# Altium project gravpower.PrjPcb
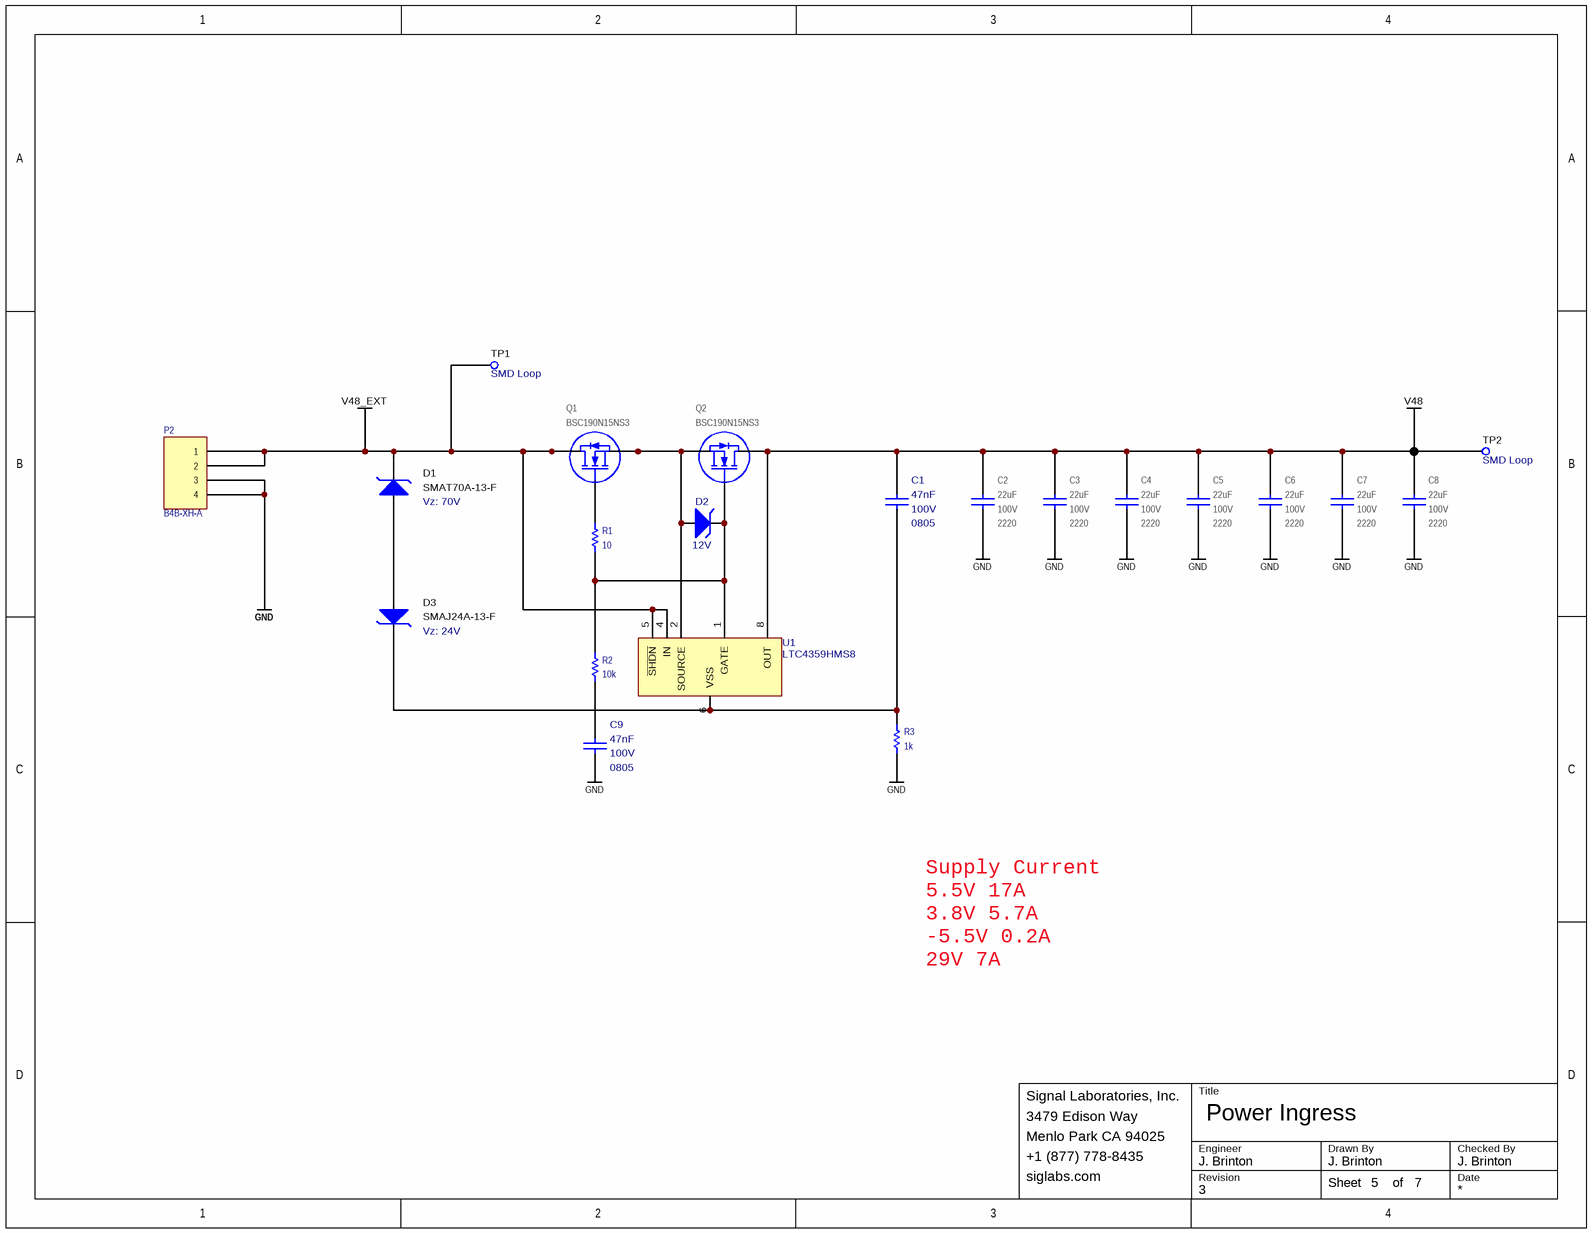
[diagram p0: ingress.SchDoc]
7 sheets, 146 parts. Net scope: global (net labels, ports and power ports of the same name join across sheets).
Board file: gravpower 007.PcbDoc
Sheets:
  ingress.SchDoc
  power-v3v8.SchDoc
  power-v5v5.SchDoc
  power-v5v5n.SchDoc
  power-v29.SchDoc
  egress.SchDoc
  mechanical.SchDoc

## Sheet ingress.SchDoc: Power Ingress
size Letter; CheckedBy: J. Brinton; CompanyName: Signal Laboratories, Inc.; DrawnBy: J. Brinton; Engineer: J. Brinton; Address1: 3479 Edison Way; Address2: Menlo Park CA 94025; Address3: +1 (877) 778-8435; Address4: siglabs.com; Revision: 3; SheetNumber: 5; SheetTotal: 7

### Parts
C1  value 47nF  Package: 0805  Voltage: 100V  [CAPC200X125X145L45N]  (hidden comment: VJ0805Y473KXB)
C2  value 22uF  Voltage: 100V  Package: 2220  [CAPC600X500X500L160N]  (hidden comment: CKG57NX7S2A226M500JJ)
C3  value 22uF  Voltage: 100V  Package: 2220  [CAPC600X500X500L160N]  (hidden comment: CKG57NX7S2A226M500JJ)
C4  value 22uF  Voltage: 100V  Package: 2220  [CAPC600X500X500L160N]  (hidden comment: CKG57NX7S2A226M500JJ)
C5  value 22uF  Voltage: 100V  Package: 2220  [CAPC600X500X500L160N]  (hidden comment: CKG57NX7S2A226M500JJ)
C6  value 22uF  Voltage: 100V  Package: 2220  [CAPC600X500X500L160N]  (hidden comment: CKG57NX7S2A226M500JJ)
C7  value 22uF  Voltage: 100V  Package: 2220  [CAPC600X500X500L160N]  (hidden comment: CKG57NX7S2A226M500JJ)
C8  value 22uF  Voltage: 100V  Package: 2220  [CAPC600X500X500L160N]  (hidden comment: CKG57NX7S2A226M500JJ)
C9  value 47nF  Package: 0805  Voltage: 100V  [CAPC200X125X145L45N]  (hidden comment: VJ0805Y473KXB)
D1  SMAT70A-13-F  Vz: 70V  [SMA]
D2  Vz: 12V  [SOD123]  (hidden comment: DDZ12BQ-7)
D3  SMAJ24A-13-F  Vz: 24V  [SMA]
P2  B4B-XH-A  [B4B-XH-A]
Q1  BSC190N15NS3  [TDSON-8]
Q2  BSC190N15NS3  [TDSON-8]
R1  value 10  [RESC1005X40N]  (hidden comment: MCS04020C1009FE000)
R2  value 10k  [RESC2012X70N]  (hidden comment: RC0805FR-0710KL)
R3  value 1k  [RESC2012X70N]  (hidden comment: RC0805FR-071KL)
TP1  Notes: SMD Loop  [5015]  (hidden comment: 5015)
TP2  Notes: SMD Loop  [5015]  (hidden comment: 5015)
U1  LTC4359HMS8  [MSOP8]

### Nets
GND: C2.1 C3.1 C4.1 C5.1 C6.1 C7.1 C8.1 C9.2 P2.3 P2.4 R3.1
V48: C1.1 C2.2 C3.2 C4.2 C5.2 C6.2 C7.2 C8.2 Q2.5(D) Q2.6(D) Q2.7(D) Q2.8(D) Q2.9(D) TP2.1 U1.8(OUT)
V48_EXT: D1.2(K) P2.1 P2.2 Q1.5(D) Q1.6(D) Q1.7(D) Q1.8(D) Q1.9(D) TP1.1 U1.4(IN) U1.5(~{SHDN})
NetC1_2: C1.2 D3.2(K) R3.2 U1.6(VSS)
NetC9_1: C9.1 R2.1
NetD1_1: D1.1(A) D3.1(A)
NetD2_1: D2.1(A) Q1.1(S) Q1.2(S) Q1.3(S) Q2.1(S) Q2.2(S) Q2.3(S) U1.2(SOURCE)
NetD2_2: D2.2(K) Q2.4(G) R1.1 R2.2 U1.1(GATE)
NetQ1_4: Q1.4(G) R1.2

Not connected (* = marked no-connect by the designer): U1 3(NC) 7(NC)

### Notes on the sheet
- Supply	Current
  5.5V	17A
  3.8V	5.7A
  -5.5V	0.2A
  29V	7A
- Title
- Engineer
- Revision
- Drawn By
- Checked By
- Date
- Sheet
- of

### Library data of the parts
C1 C9 = VJ0805Y473KXB: Ceramic Capacitor 47nF ±10% 100V X7R 0805; Manufacturer: Vishay; Tr: -55:150; Manufacturer P/N: VJ0805Y473KXB; Tolerance: ±10%
C2-C8 = CAP: Ceramic Capacitor 22uF ±20% 100V X7S Stacked; Manufacturer: TDK; Tr: -55:125; Manufacturer P/N: CKG57NX7S2A226M500JJ; Tolerance: ±20%
D1 = TVS: TVS Diode 70V/100V SMA; Manufacturer: Diodes Inc; Manufacturer P/N: SMAT70A-13-F
D2 = ZENER: Zener Diode 12V 370mW SOD123; Manufacturer: Diodes Inc; Manufacturer P/N: DDZ12BQ-7; Package: SOD-123
D3 = TVS: TVS Diode 24V/38.9V SMA; Manufacturer: Diodes Inc; Manufacturer P/N: SMAJ24A-13-F
P2 = S4B-XH-A: 2.5mm pitch 4-position connector; Manufacturer: JST; Manufacturer P/N: B4B-XH-A
Q1 Q2 = BSC190N15NS3: MOSFET N-Channel Enhancement Mode; Manufacturer: Infineon; Vds(max): 150V; Id(max): 50A; Rds(on): 19mOhm; Manufacturer P/N: BSC190N15NS3
R1 = RES: Thin Film Resistor 10 Ohm ±1% 0402; Manufacturer: Vishay; Tr: -55:155; Tcr: *; Tolerance: ±1%; Manufacturer P/N: MCS04020C1009FE000; Alternatives: *; Power: *; Package: 0402
R2 = RES: Thin Film Resistor 10k +/-1% SMD 0805; Manufacturer: Yageo; Tolerance: ±1%; Tr: -55:155; Voltage: 150V; Tcr: *; Manufacturer P/N: RC0805FR-0710KL; Alternatives: *; Power: *; Package: 0805
R3 = RES: Thin Film Resistor 1k +/-1% SMD 0805; Manufacturer: Yageo; Tolerance: ±1%; Tr: -55:155; Voltage: 150V; Tcr: *; Manufacturer P/N: RC0805FR-071KL; Alternatives: *; Power: *; Package: 0805
TP1 TP2 = TEST_POINT_SMD_50: Test Point SMD; Manufacturer: Keystone; Manufacturer P/N: 5015
U1 = LTC4359HMS8: Ideal Diode Controller; Manufacturer: Linear Technology; Manufacturer P/N: LTC4359HMS8

## Sheet power-v3v8.SchDoc: Power 3.8V
size Letter; CheckedBy: J. Brinton; CompanyName: Signal Laboratories, Inc.; DrawnBy: J. Brinton; Engineer: J. Brinton; Address1: 3479 Edison Way; Address2: Menlo Park CA 94025; Address3: +1 (877) 778-8435; Address4: siglabs.com; Revision: 3; SheetNumber: 3; SheetTotal: 7
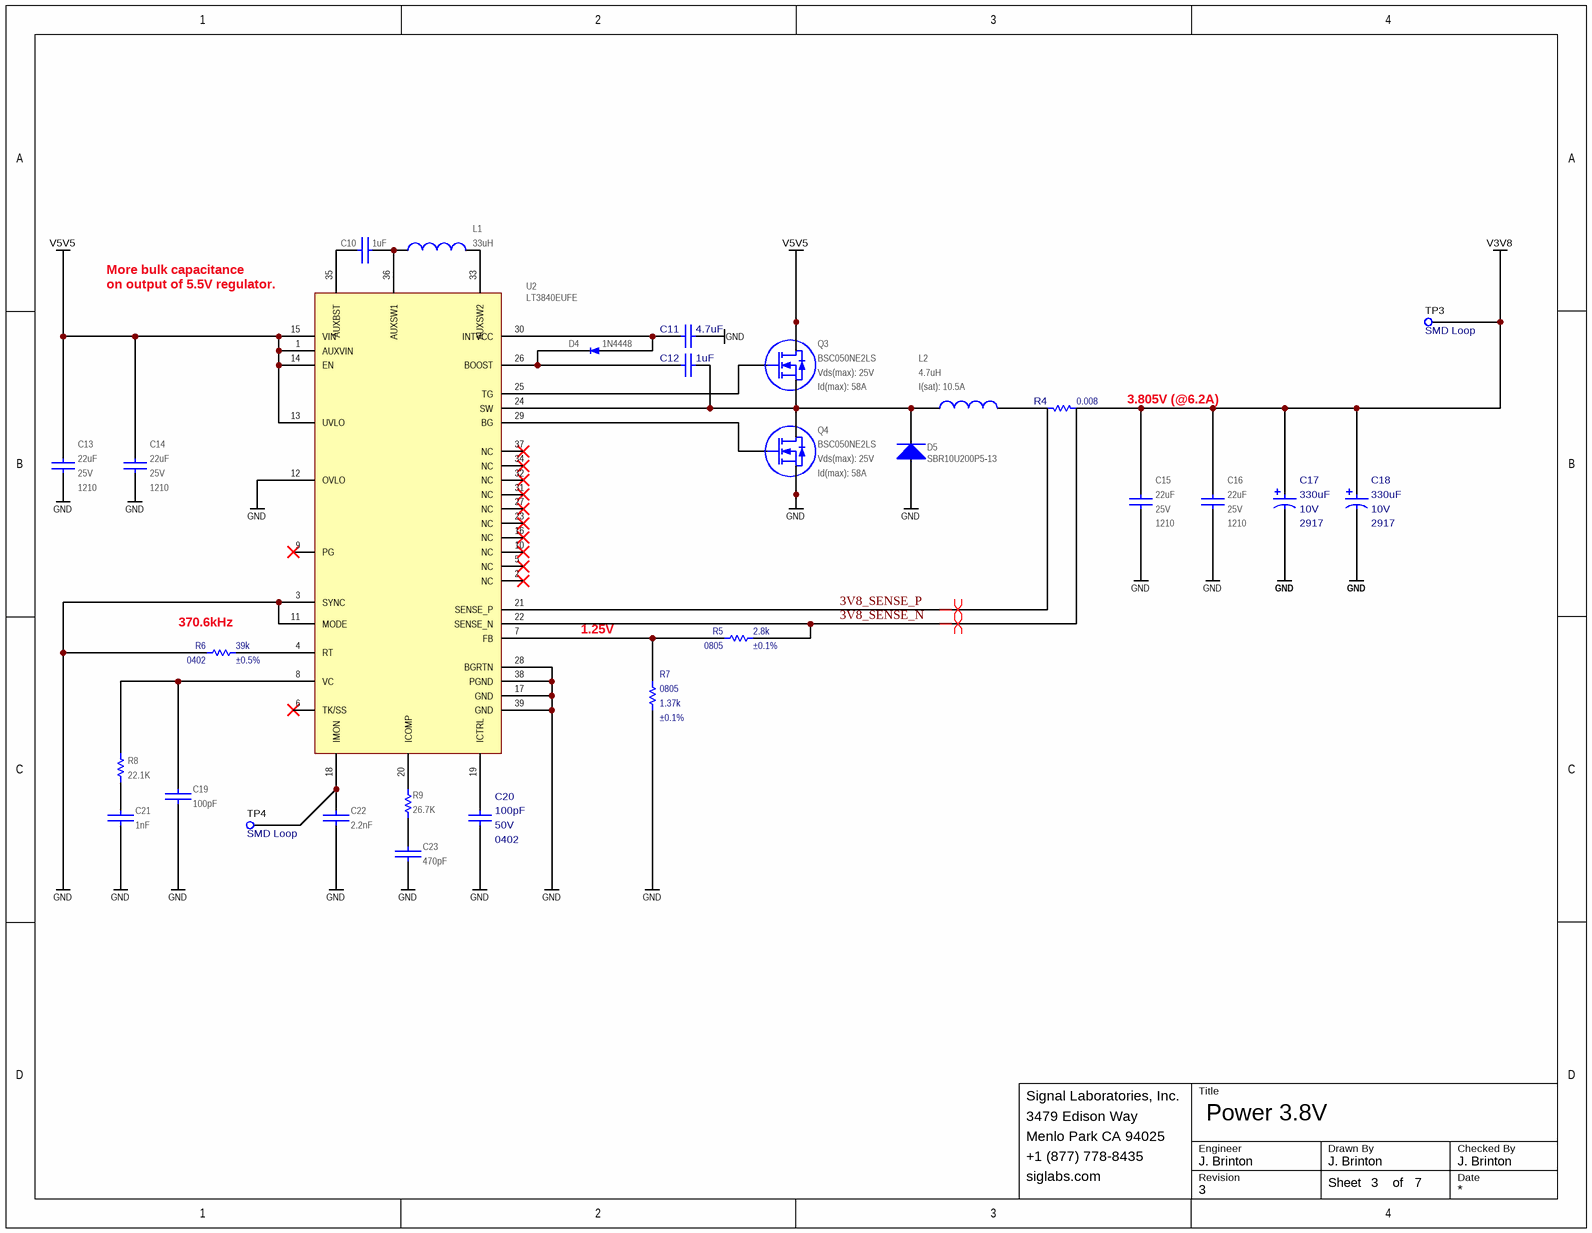
[diagram p1: power-v3v8.SchDoc]

### Parts
C10  value 1uF  [CAPC100X50X55L25N]  (hidden comment: GRM155R61A105KE15)
C11  value 4.7uF  [CAPC160X80X90L20NA]  (hidden comment: CL10A475KA8NQNC)
C12  value 1uF  [CAPC100X50X55L25N]  (hidden comment: GRM155R61A105KE15)
C13  value 22uF  Voltage: 25V  Package: 1210  [CAPC320X250X270L50N]  (hidden comment: GRM32ER71E226KE15)
C14  value 22uF  Voltage: 25V  Package: 1210  [CAPC320X250X270L50N]  (hidden comment: GRM32ER71E226KE15)
C15  value 22uF  Voltage: 25V  Package: 1210  [CAPC320X250X270L50N]  (hidden comment: GRM32ER71E226KE15)
C16  value 22uF  Voltage: 25V  Package: 1210  [CAPC320X250X270L50N]  (hidden comment: GRM32ER71E226KE15)
C17  value 330uF  Package: 2917  Voltage: 10V  [CAPPM730X435X310L135X240N]  (hidden comment: TPSE337K010R0050)
C18  value 330uF  Package: 2917  Voltage: 10V  [CAPPM730X435X310L135X240N]  (hidden comment: TPSE337K010R0050)
C19  value 100pF  [CAPC100X50X55L25N]  (hidden comment: GRM1555C1H101FA01D)
C20  value 100pF  Package: 0402  Voltage: 50V  [CAPC100X50X55L25N]  (hidden comment: VJ0402A101KXA)
C21  value 1nF  [CAPC100X50X55L25N]  (hidden comment: GRM1555C1H102JA01)
C22  value 2.2nF  [CAPC100X50X55L25N]  (hidden comment: C0402C222J3GACTU)
C23  value 470pF  [CAPC100X50X55L25N]  (hidden comment: GRM155R71H471JA01)
D4  Alternative P/N: 1N4448  [SOD323]  (hidden comment: 1N4448HWS-7-F)
D5  SBR10U200P5-13  [DIODES_POWERDI5]
L1  value 33uH  [ME3220]  (hidden comment: ME3220-333KL)
L2  value 4.7uH  I(sat): 10.5A  [XAL6060]  (hidden comment: XAL6060-472ME)
Q3  BSC050NE2LS  Vds(max): 25V  Id(max): 58A  [TDSON-8]
Q4  BSC050NE2LS  Vds(max): 25V  Id(max): 58A  [TDSON-8]
R4  value 0.008  [KRL3216T4]  (hidden comment: KRL3216T4A-M-R008-F)
R5  value 2.8k  Tolerance: ±0.1%  Package: 0805  [RESC2012X70N]  (hidden comment: RT0805BRD072K8L)
R6  value 39k  Tolerance: ±0.5%  Package: 0402  [RESC1005X40N]  (hidden comment: RR0510P-393-D)
R7  value 1.37k  Tolerance: ±0.1%  Package: 0805  [RESC2012X70N]  (hidden comment: RT0805BRD071K37L)
R8  value 22.1K  [RESC1005X40N]  (hidden comment: ERJ-2RKF2212X)
R9  value 26.7K  [RESC1005X40N]  (hidden comment: ERJ-2RKF2672X)
TP3  Notes: SMD Loop  [5015]  (hidden comment: 5015)
TP4  Notes: SMD Loop  [5015]  (hidden comment: 5015)
U2  LT3840EUFE  [QFN39P40_600X400X80L40X20T465X265N]

### Nets
GND: C11.2 C13.1 C14.1 C15.1 C16.1 C17.2 C18.2 C19.1 C20.2 C21.2 C22.2 C23.1 D5.A Q4.1(S) Q4.2(S) Q4.3(S) R6.2 R7.1 U2.3(SYNC) U2.11(MODE) U2.12(OVLO) U2.17(GND) U2.28(BGRTN) U2.38(PGND) U2.39(GND)
V3V8: C15.2 C16.2 C17.1 C18.1 R4.2 TP3.1
V5V5: C13.2 C14.2 Q3.5(D) Q3.6(D) Q3.7(D) Q3.8(D) Q3.9(D) U2.1(AUXVIN) U2.13(UVLO) U2.14(EN) U2.15(VIN)
3V8_SENSE_N: R4.4 R5.1 U2.22(SENSE_N)
3V8_SENSE_P: R4.3 U2.21(SENSE_P)
NetC10_1: C10.1 L1.1 U2.36(AUXSW1)
NetC10_2: C10.2 U2.35(AUXBST)
NetC11_1: C11.1 D4.A U2.30(INTVCC)
NetC12_1: C12.1 D4.K U2.26(BOOST)
NetC12_2: C12.2 D5.K L2.1 Q3.1(S) Q3.2(S) Q3.3(S) Q4.5(D) Q4.6(D) Q4.7(D) Q4.8(D) Q4.9(D) U2.24(SW)
NetC19_2: C19.2 R8.2 U2.8(VC)
NetC20_1: C20.1 U2.19(ICTRL)
NetC21_1: C21.1 R8.1
NetC22_1: C22.1 TP4.1 U2.18(IMON)
NetC23_2: C23.2 R9.2
NetL1_2: L1.2 U2.33(AUXSW2)
NetL2_2: L2.2 R4.1
NetQ3_4: Q3.4(G) U2.25(TG)
NetQ4_4: Q4.4(G) U2.29(BG)
NetR5_2: R5.2 R7.2 U2.7(FB)
NetR6_1: R6.1 U2.4(RT)
NetR9_1: R9.1 U2.20(ICOMP)

Not connected (* = marked no-connect by the designer): U2 2(NC)* 5(NC)* 6(TK/SS)* 9(PG)* 10(NC)* 16(NC)* 23(NC)* 27(NC)* 31(NC)* 32(NC)* 34(NC)* 37(NC)*

### Layout directives
differential pair: 3V8_SENSE_N, 3V8_SENSE_P

### Notes on the sheet
- More bulk capacitance
- (near U2) on output of 5.5V regulator.
- (near R4) 3.805V (@6.2A)
- (near R6) 370.6kHz
- 1.25V
- Title
- Engineer
- Revision
- Drawn By
- Checked By
- Date
- Sheet
- of

### Library data of the parts
C10 = CAP: Ceramic Capacitor 1uF ±10% 10V X5R 0402; Manufacturer: Murata; Tr: -55:125; Manufacturer P/N: GRM155R61A105KE15; Package: 0402; Tolerance: ±10%; Voltage: 10V
C11 = TMK212B7475KG: Ceramic Capacitor 4.7uF ±10% 25V X5R 0603; Manufacturer: Samsung; Tr: -55:85; Manufacturer P/N: CL10A475KA8NQNC; Tolerance: ±10%; Package: 0603; Voltage: 25V
C12 = UMK212B7105KG: Ceramic Capacitor 1uF ±10% 10V X5R 0402; Manufacturer: Murata; Voltage: 50V; Manufacturer P/N: GRM155R61A105KE15; Tolerance: ±10%; Tr: *; Package: 0402
C13-C16 = CAP: Ceramic Capacitor 22uF ±10% 25V X7R 1210; Manufacturer: Murata; Tr: -55:125; Manufacturer P/N: GRM32ER71E226KE15; Tolerance: ±10%
C17 C18 = CAP_POL: Tantalum Capacitor 330uF ±10% 10V 2917; Manufacturer: AVX; Tr: -55:125; Manufacturer P/N: TPSE337K010R0050; Tolerance: ±10%
C19 = CAP: Ceramic Capacitor 100pF ±1% 50V NP0 0402; Manufacturer: Murata; Tr: -55:125; Manufacturer P/N: GRM1555C1H101FA01D; Voltage: 50V; Package: 0402; Tolerance: ±1%
C20 = VJ0402A101KXA: Ceramic Capacitor 100pF ±10% 50V C0G 0402; Manufacturer: Vishay; Tr: -55:150; Manufacturer P/N: VJ0402A101KXA; Tolerance: ±10%
C21 = CAP: Ceramic Capacitor 1nF ±5% 50V NP0 0402; Manufacturer: Murata; Tr: -55:125; Manufacturer P/N: GRM1555C1H102JA01; Voltage: 50V; Package: 0402; Tolerance: ±5%
C22 = CAP: Ceramic Capacitor 2.2nF ±5% 25V NP0 0402; Manufacturer: Kemet; Tr: -55:125; Manufacturer P/N: C0402C222J3GACTU; Package: 0402; Tolerance: ±5%; Voltage: 25V
C23 = CAP: Ceramic Capacitor 470pF ±5% 50V X7R 0402; Manufacturer: Murata; Tr: -55:125; Manufacturer P/N: GRM155R71H471JA01; Voltage: 50V; Package: 0402; Tolerance: ±5%
D4 = 1N4448HWS-7-F: Schottky Diode 80V 250mA SOD323; Manufacturer: Diodes Inc; Manufacturer P/N: 1N4448HWS-7-F; Package: SOD323
D5 = PDS5100H: Schottky Diode 200V 10A SMD; Manufacturer: Diodes Inc; Manufacturer P/N: SBR10U200P5-13; Current: 10A; Reverse Voltage (max): 200V; Package: PowerDi-5
L1 = COIL: Inductor 33uH ±10% 500mA SMD; Manufacturer: Coilcraft; Tr: -40:85; Manufacturer P/N: ME3220-333KL; I(sat): 500mA; Package: *; Tolerance: ±10%
L2 = COIL: Inductor 4.7uH,10.5A(sat), SMD; Manufacturer: Coilcraft; Manufacturer P/N: XAL6060-472ME
Q3 Q4 = BSC190N15NS3: MOSFET N-Channel Enhancement Mode; Manufacturer: Infineon; Rds(on): 5mOhm; Manufacturer P/N: BSC050NE2LS
R4 = KRL3216T4A-M-R009-F: Current Sense Resistor 8 mOhms +/-1% SMD 4-Terminal; Manufacturer: Susumu; Tolerance: ±1%; Tr: -55:+155; Manufacturer P/N: KRL3216T4A-M-R008-F
R5 = RES: Thin Film Resistor 2.8k +/-0.1% SMD 0805; Manufacturer: Yageo; Tr: -55:155; Tcr: *; Manufacturer P/N: RT0805BRD072K8L; Alternatives: *; Voltage: *; Power: *
R6 = RES: Thin Film Resistor 39k +/-0.5% SMD 0402; Manufacturer: Susumu; Tr: -55:155; Tcr: *; Manufacturer P/N: RR0510P-393-D; Alternatives: *; Voltage: *; Power: *
R7 = RES: Thin Film Resistor 1.37k +/-0.1% SMD 0805; Manufacturer: Yageo; Tr: -55:155; Tcr: *; Manufacturer P/N: RT0805BRD071K37L; Alternatives: *; Voltage: *; Power: *
R8 = RES 0402: Thick Film Resistor 22.1k ±1% 0402; Manufacturer: Panasonic; Tr: -55:155; Package: 0402; Manufacturer P/N: ERJ-2RKF2212X; Tolerance: ±1%
R9 = RES 0402: Thick Film Resistor 26.7k ±1% 0402; Manufacturer: Panasonic; Tr: -55:155; Package: 0402; Manufacturer P/N: ERJ-2RKF2672X; Tolerance: ±1%
TP3 TP4 = TEST_POINT_SMD_50: Test Point SMD; Manufacturer: Keystone; Manufacturer P/N: 5015
U2 = LT3840EUFE: Synchronous Regulator Controller; Manufacturer: Linear Technology; Alternative P/N: LT3840IUFE; Manufacturer P/N: LT3840EUFE

## Sheet power-v5v5.SchDoc: Power 5.5V
size Letter; CheckedBy: J. Brinton; CompanyName: Signal Laboratories, Inc.; DrawnBy: J. Brinton; Engineer: J. Brinton; Address1: 3479 Edison Way; Address2: Menlo Park CA 94025; Address3: +1 (877) 778-8435; Address4: siglabs.com; Revision: 3; SheetNumber: 2; SheetTotal: 7
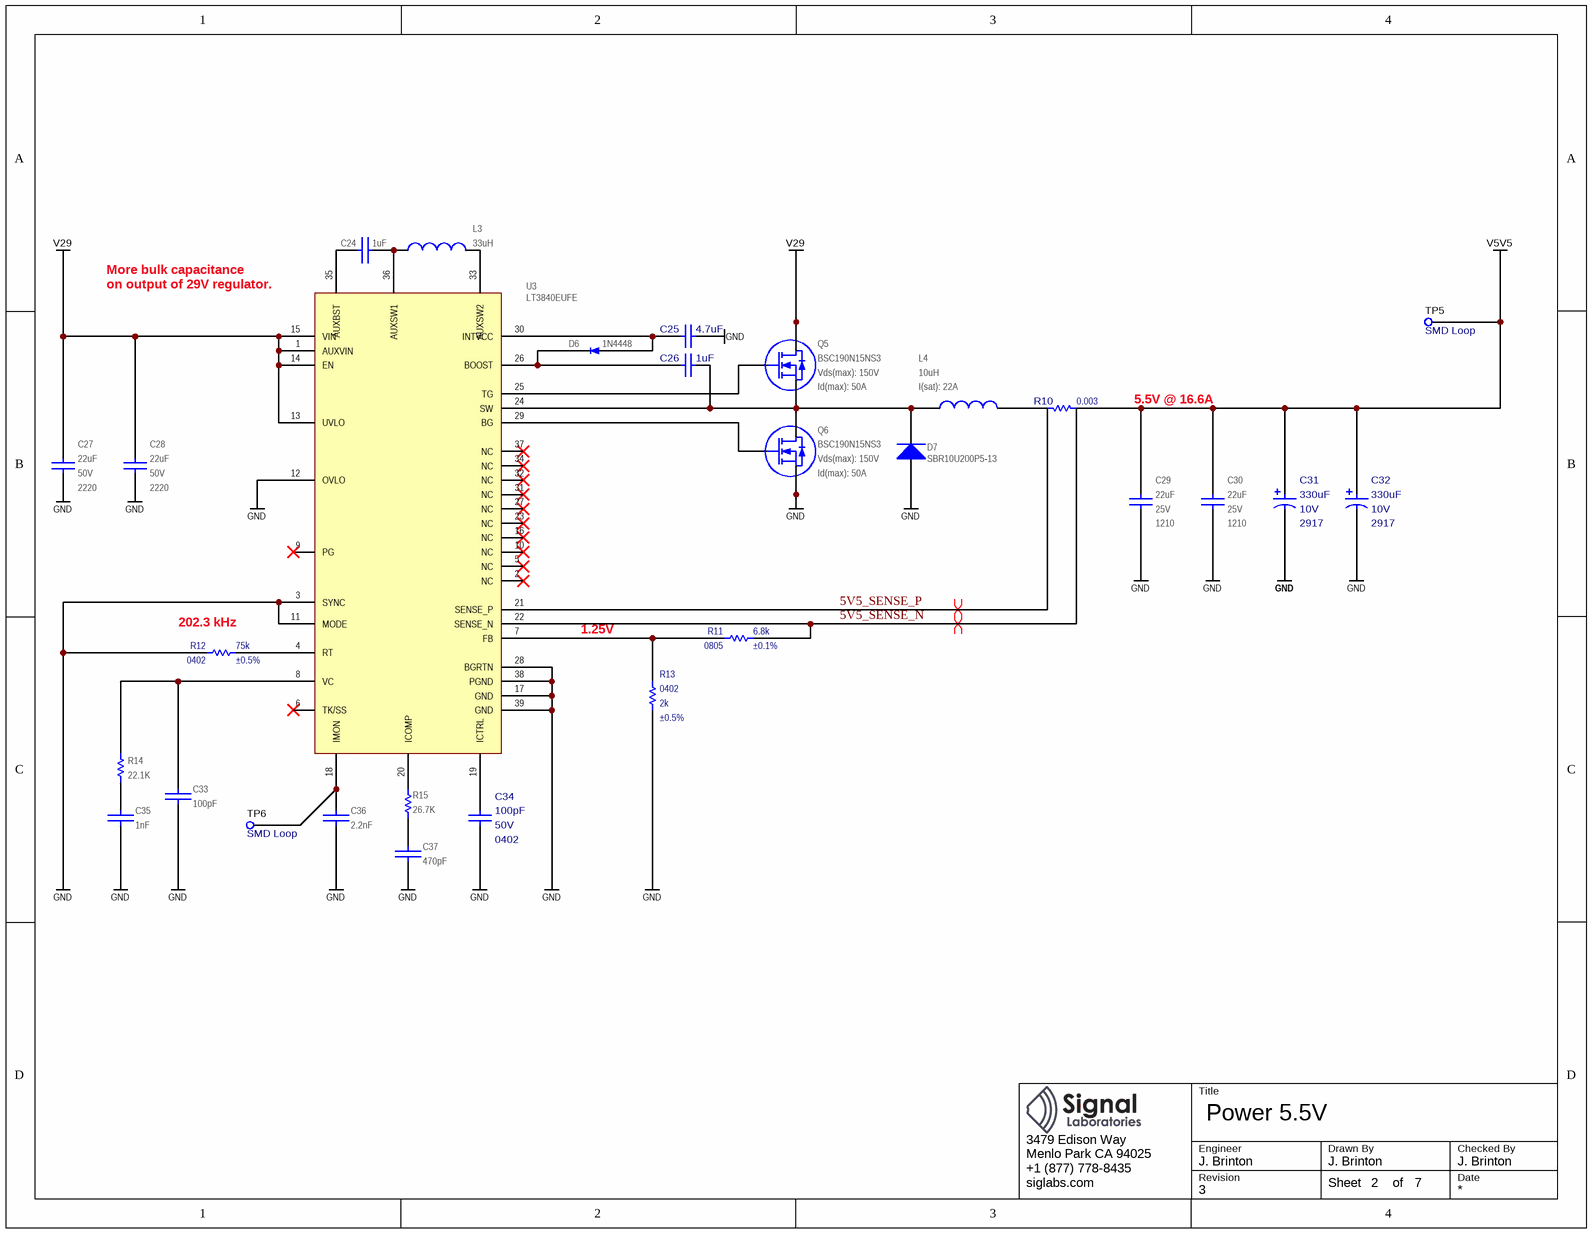
[diagram p2: power-v5v5.SchDoc]

### Parts
C24  value 1uF  [CAPC100X50X55L25N]  (hidden comment: GRM155R61A105KE15)
C25  value 4.7uF  [CAPC160X80X90L20NA]  (hidden comment: CL10A475KA8NQNC)
C26  value 1uF  [CAPC100X50X55L25N]  (hidden comment: GRM155R61A105KE15)
C27  value 22uF  Voltage: 50V  Package: 2220  [CAPC600X500X500L160N]  (hidden comment: CKG57NX7S1H226M500JJ)
C28  value 22uF  Voltage: 50V  Package: 2220  [CAPC600X500X500L160N]  (hidden comment: CKG57NX7S1H226M500JJ)
C29  value 22uF  Voltage: 25V  Package: 1210  [CAPC320X250X270L50N]  (hidden comment: GRM32ER71E226KE15)
C30  value 22uF  Voltage: 25V  Package: 1210  [CAPC320X250X270L50N]  (hidden comment: GRM32ER71E226KE15)
C31  value 330uF  Package: 2917  Voltage: 10V  [CAPPM730X435X310L135X240N]  (hidden comment: TPSE337K010R0050)
C32  value 330uF  Package: 2917  Voltage: 10V  [CAPPM730X435X310L135X240N]  (hidden comment: TPSE337K010R0050)
C33  value 100pF  [CAPC100X50X55L25N]  (hidden comment: GRM1555C1H101FA01D)
C34  value 100pF  Package: 0402  Voltage: 50V  [CAPC100X50X55L25N]  (hidden comment: VJ0402A101KXA)
C35  value 1nF  [CAPC100X50X55L25N]  (hidden comment: GRM1555C1H102JA01)
C36  value 2.2nF  [CAPC100X50X55L25N]  (hidden comment: C0402C222J3GACTU)
C37  value 470pF  [CAPC100X50X55L25N]  (hidden comment: GRM155R71H471JA01)
D6  Alternative P/N: 1N4448  [SOD323]  (hidden comment: 1N4448HWS-7-F)
D7  SBR10U200P5-13  [DIODES_POWERDI5]
L3  value 33uH  [ME3220]  (hidden comment: ME3220-333KL)
L4  value 10uH  I(sat): 22A  [HCM1A1707]  (hidden comment: PA4344.103ANLT)
Q5  BSC190N15NS3  Vds(max): 150V  Id(max): 50A  [TDSON-8]
Q6  BSC190N15NS3  Vds(max): 150V  Id(max): 50A  [TDSON-8]
R10  value 0.003  [KRL3216T4]  (hidden comment: KRL3216T4A-M-R003-F)
R11  value 6.8k  Tolerance: ±0.1%  Package: 0805  [RESC2012X70N]  (hidden comment: RG2012P-682-B-T5)
R12  value 75k  Tolerance: ±0.5%  Package: 0402  [RESC1005X40N]  (hidden comment: RR0510P-753-D)
R13  value 2k  Tolerance: ±0.5%  Package: 0402  [RESC1005X40N]  (hidden comment: RR0510P-202-D)
R14  value 22.1K  [RESC1005X40N]  (hidden comment: ERJ-2RKF2212X)
R15  value 26.7K  [RESC1005X40N]  (hidden comment: ERJ-2RKF2672X)
TP5  Notes: SMD Loop  [5015]  (hidden comment: 5015)
TP6  Notes: SMD Loop  [5015]  (hidden comment: 5015)
U3  LT3840EUFE  [QFN39P40_600X400X80L40X20T465X265N]

### Nets
GND: C25.2 C27.1 C28.1 C29.1 C30.1 C31.2 C32.2 C33.1 C34.2 C35.2 C36.2 C37.1 D7.A Q6.1(S) Q6.2(S) Q6.3(S) R12.2 R13.1 U3.3(SYNC) U3.11(MODE) U3.12(OVLO) U3.17(GND) U3.28(BGRTN) U3.38(PGND) U3.39(GND)
V5V5: C29.2 C30.2 C31.1 C32.1 R10.2 TP5.1
V29: C27.2 C28.2 Q5.5(D) Q5.6(D) Q5.7(D) Q5.8(D) Q5.9(D) U3.1(AUXVIN) U3.13(UVLO) U3.14(EN) U3.15(VIN)
5V5_SENSE_N: R10.4 R11.1 U3.22(SENSE_N)
5V5_SENSE_P: R10.3 U3.21(SENSE_P)
NetC24_1: C24.1 L3.1 U3.36(AUXSW1)
NetC24_2: C24.2 U3.35(AUXBST)
NetC25_1: C25.1 D6.A U3.30(INTVCC)
NetC26_1: C26.1 D6.K U3.26(BOOST)
NetC26_2: C26.2 D7.K L4.1 Q5.1(S) Q5.2(S) Q5.3(S) Q6.5(D) Q6.6(D) Q6.7(D) Q6.8(D) Q6.9(D) U3.24(SW)
NetC33_2: C33.2 R14.2 U3.8(VC)
NetC34_1: C34.1 U3.19(ICTRL)
NetC35_1: C35.1 R14.1
NetC36_1: C36.1 TP6.1 U3.18(IMON)
NetC37_2: C37.2 R15.2
NetL3_2: L3.2 U3.33(AUXSW2)
NetL4_2: L4.2 R10.1
NetQ5_4: Q5.4(G) U3.25(TG)
NetQ6_4: Q6.4(G) U3.29(BG)
NetR11_2: R11.2 R13.2 U3.7(FB)
NetR12_1: R12.1 U3.4(RT)
NetR15_1: R15.1 U3.20(ICOMP)

Not connected (* = marked no-connect by the designer): U3 2(NC)* 5(NC)* 6(TK/SS)* 9(PG)* 10(NC)* 16(NC)* 23(NC)* 27(NC)* 31(NC)* 32(NC)* 34(NC)* 37(NC)*

### Layout directives
differential pair: 5V5_SENSE_N, 5V5_SENSE_P

### Notes on the sheet
- More bulk capacitance
- (near U3) on output of 29V regulator.
- 5.5V @ 16.6A
- (near R12) 202.3 kHz
- 1.25V
- Title
- Engineer
- Revision
- Drawn By
- Checked By
- Date
- Sheet
- of

### Library data of the parts
C24 = CAP: as C10 on sheet power-v3v8; Manufacturer P/N: GRM155R61A105KE15; Package: 0402; Tolerance: ±10%; Voltage: 10V
C25 = TMK212B7475KG: as C11 on sheet power-v3v8; Manufacturer P/N: CL10A475KA8NQNC; Tolerance: ±10%; Package: 0603; Voltage: 25V
C26 = UMK212B7105KG: as C12 on sheet power-v3v8; Manufacturer P/N: GRM155R61A105KE15; Tolerance: ±10%; Tr: *; Package: 0402
C27 C28 = CAP: Ceramic Capacitor 22uF ±20% 50V X7S Stacked; Manufacturer: TDK; Tr: -55:125; Manufacturer P/N: CKG57NX7S1H226M500JJ; Tolerance: ±20%
C29 C30 = CAP: as C13 on sheet power-v3v8; Manufacturer P/N: GRM32ER71E226KE15; Tolerance: ±10%
C31 C32 = CAP_POL: as C17 on sheet power-v3v8; Manufacturer P/N: TPSE337K010R0050; Tolerance: ±10%
C33 = CAP: as C19 on sheet power-v3v8; Manufacturer P/N: GRM1555C1H101FA01D; Voltage: 50V; Package: 0402; Tolerance: ±1%
C34 = VJ0402A101KXA: as C20 on sheet power-v3v8; Manufacturer P/N: VJ0402A101KXA; Tolerance: ±10%
C35 = CAP: as C21 on sheet power-v3v8; Manufacturer P/N: GRM1555C1H102JA01; Voltage: 50V; Package: 0402; Tolerance: ±5%
C36 = CAP: as C22 on sheet power-v3v8; Manufacturer P/N: C0402C222J3GACTU; Package: 0402; Tolerance: ±5%; Voltage: 25V
C37 = CAP: as C23 on sheet power-v3v8; Manufacturer P/N: GRM155R71H471JA01; Voltage: 50V; Package: 0402; Tolerance: ±5%
D6 = 1N4448HWS-7-F: as D4 on sheet power-v3v8; Manufacturer P/N: 1N4448HWS-7-F; Package: SOD323
D7 = PDS5100H: as D5 on sheet power-v3v8; Manufacturer P/N: SBR10U200P5-13; Current: 10A; Reverse Voltage (max): 200V; Package: PowerDi-5
L3 = COIL: as L1 on sheet power-v3v8; Manufacturer P/N: ME3220-333KL; I(sat): 500mA; Package: *; Tolerance: ±10%
L4 = COIL: Inductor 10uH, 22A(sat), SMD; Manufacturer: Pulse Electronics Power; Notes: Same size inductor as HCM1A1707; Manufacturer P/N: PA4344.103ANLT
Q5 Q6 = BSC190N15NS3: MOSFET N-Channel Enhancement Mode; Manufacturer: Infineon; Rds(on): 19mOhm; Manufacturer P/N: BSC190N15NS3
R10 = KRL3216T4A-M-R009-F: Current Sense Resistor 3 mOhms +/-1% SMD 4-Terminal; Manufacturer: Susumu; Tolerance: ±1%; Tr: -55:+155; Manufacturer P/N: KRL3216T4A-M-R003-F
R11 = RES: Thin Film Resistor 6.8k +/-0.1% SMD 0805; Manufacturer: Susumu; Tr: -55:155; Tcr: *; Manufacturer P/N: RG2012P-682-B-T5; Alternatives: *; Voltage: *; Power: *
R12 = RES: Thin Film Resistor 75k +/-0.5% SMD 0402; Manufacturer: Susumu; Tr: -55:155; Tcr: *; Manufacturer P/N: RR0510P-753-D; Alternatives: *; Voltage: *; Power: *
R13 = RES: Thin Film Resistor 2k +/-0.5% SMD 0402; Manufacturer: Susumu; Tr: -55:155; Tcr: *; Manufacturer P/N: RR0510P-202-D; Alternatives: *; Voltage: *; Power: *
R14 = RES 0402: as R8 on sheet power-v3v8; Package: 0402; Manufacturer P/N: ERJ-2RKF2212X; Tolerance: ±1%
R15 = RES 0402: as R9 on sheet power-v3v8; Package: 0402; Manufacturer P/N: ERJ-2RKF2672X; Tolerance: ±1%
TP5 TP6 = TEST_POINT_SMD_50: Test Point SMD; Manufacturer: Keystone; Manufacturer P/N: 5015
U3 = LT3840EUFE: as U2 on sheet power-v3v8; Manufacturer P/N: LT3840EUFE

## Sheet power-v5v5n.SchDoc: Power -5.5V
size Letter; CheckedBy: J. Brinton; CompanyName: Signal Laboratories, Inc.; DrawnBy: J. Brinton; Engineer: J. Brinton; Address1: 3479 Edison Way; Address2: Menlo Park CA 94025; Address3: +1 (877) 778-8435; Address4: siglabs.com; Revision: 3; SheetNumber: 4; SheetTotal: 7
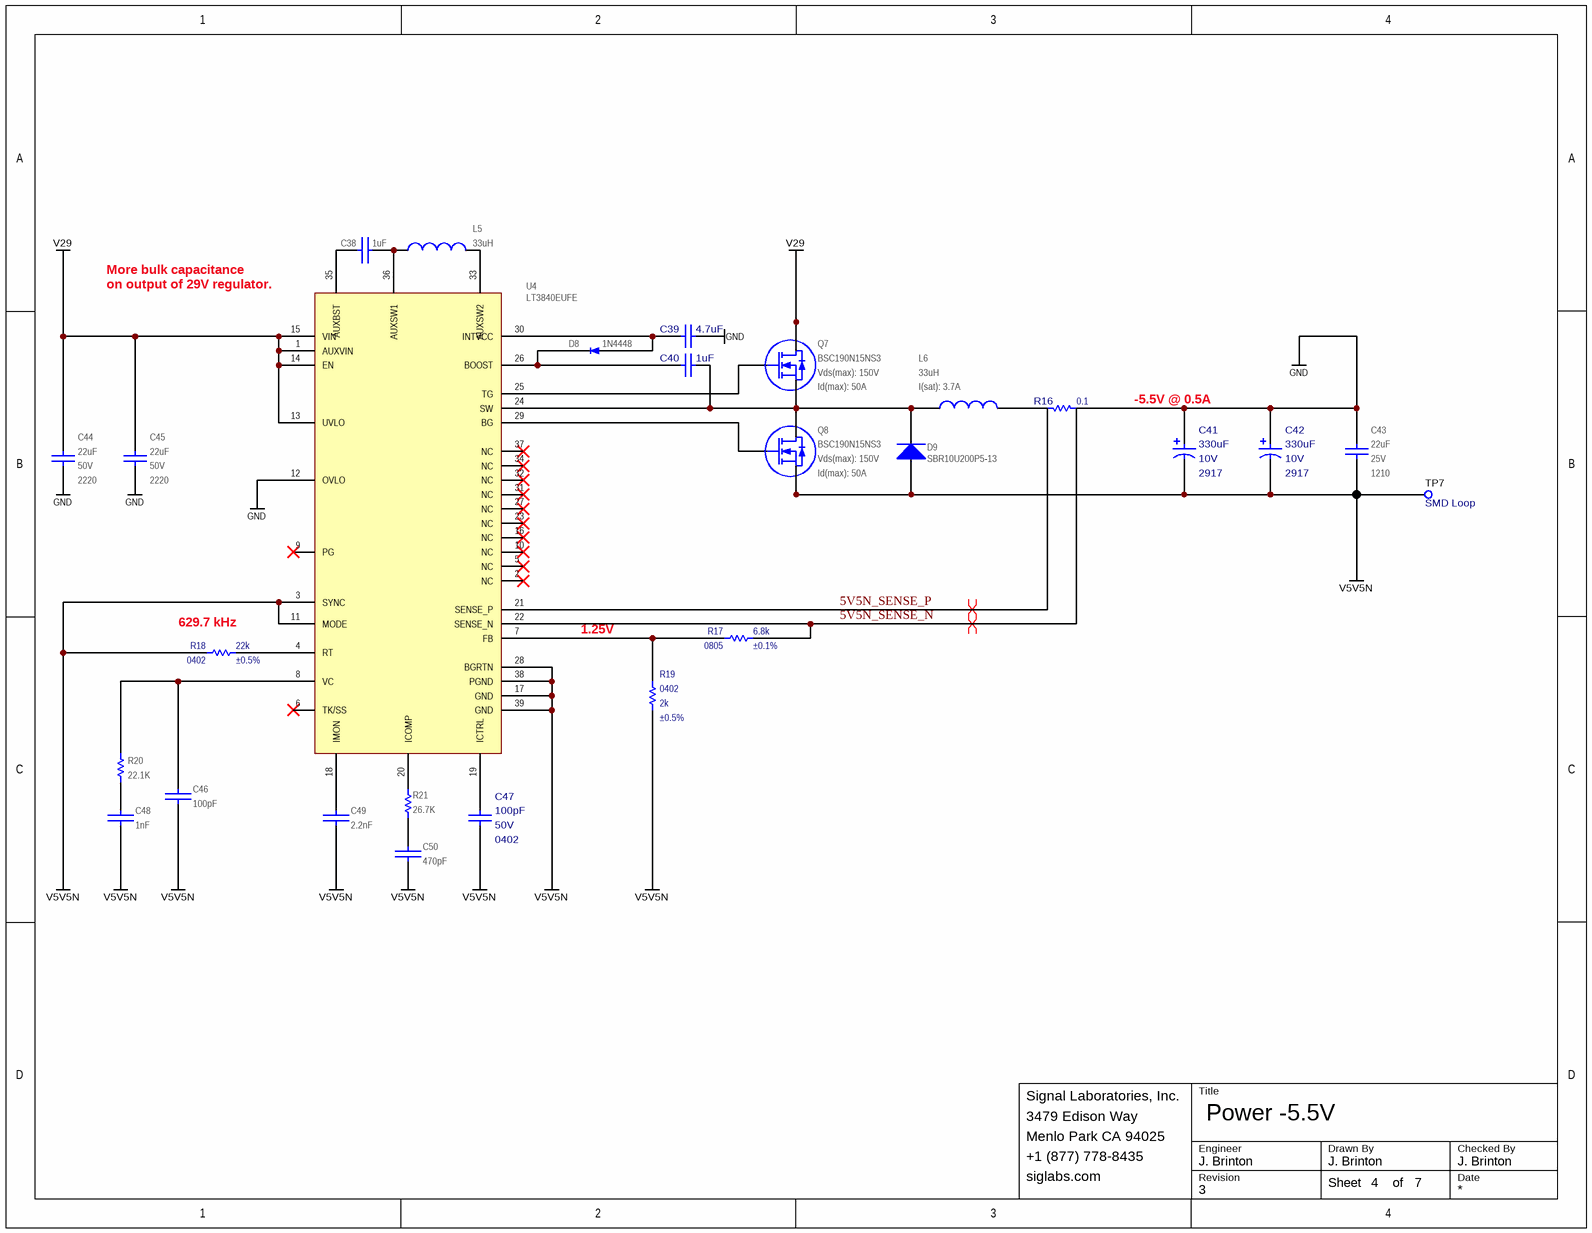
[diagram p3: power-v5v5n.SchDoc]

### Parts
C38  value 1uF  [CAPC100X50X55L25N]  (hidden comment: GRM155R61A105KE15)
C39  value 4.7uF  [CAPC160X80X90L20NA]  (hidden comment: CL10A475KA8NQNC)
C40  value 1uF  [CAPC100X50X55L25N]  (hidden comment: GRM155R61A105KE15)
C41  value 330uF  Package: 2917  Voltage: 10V  [CAPPM730X435X310L135X240N]  (hidden comment: TPSE337K010R0050)
C42  value 330uF  Package: 2917  Voltage: 10V  [CAPPM730X435X310L135X240N]  (hidden comment: TPSE337K010R0050)
C43  value 22uF  Voltage: 25V  Package: 1210  [CAPC320X250X270L50N]  (hidden comment: GRM32ER71E226KE15)
C44  value 22uF  Voltage: 50V  Package: 2220  [CAPC600X500X500L160N]  (hidden comment: CKG57NX7S1H226M500JJ)
C45  value 22uF  Voltage: 50V  Package: 2220  [CAPC600X500X500L160N]  (hidden comment: CKG57NX7S1H226M500JJ)
C46  value 100pF  [CAPC100X50X55L25N]  (hidden comment: GRM1555C1H101FA01D)
C47  value 100pF  Package: 0402  Voltage: 50V  [CAPC100X50X55L25N]  (hidden comment: VJ0402A101KXA)
C48  value 1nF  [CAPC100X50X55L25N]  (hidden comment: GRM1555C1H102JA01)
C49  value 2.2nF  [CAPC100X50X55L25N]  (hidden comment: C0402C222J3GACTU)
C50  value 470pF  [CAPC100X50X55L25N]  (hidden comment: GRM155R71H471JA01)
D8  Alternative P/N: 1N4448  [SOD323]  (hidden comment: 1N4448HWS-7-F)
D9  SBR10U200P5-13  [DIODES_POWERDI5]
L5  value 33uH  [ME3220]  (hidden comment: ME3220-333KL)
L6  value 33uH  I(sat): 3.7A  [XAL6060]  (hidden comment: XAL6060-333ME)
Q7  BSC190N15NS3  Vds(max): 150V  Id(max): 50A  [TDSON-8]
Q8  BSC190N15NS3  Vds(max): 150V  Id(max): 50A  [TDSON-8]
R16  value 0.1  [KRL3216T4]  (hidden comment: KRL3216T4A-M-R100-F)
R17  value 6.8k  Tolerance: ±0.1%  Package: 0805  [RESC2012X70N]  (hidden comment: RG2012P-682-B-T5)
R18  value 22k  Tolerance: ±0.5%  Package: 0402  [RESC1005X40N]  (hidden comment: RR0510P-223-D)
R19  value 2k  Tolerance: ±0.5%  Package: 0402  [RESC1005X40N]  (hidden comment: RR0510P-202-D)
R20  value 22.1K  [RESC1005X40N]  (hidden comment: ERJ-2RKF2212X)
R21  value 26.7K  [RESC1005X40N]  (hidden comment: ERJ-2RKF2672X)
TP7  Notes: SMD Loop  [5015]  (hidden comment: 5015)
U4  LT3840EUFE  [QFN39P40_600X400X80L40X20T465X265N]

### Nets
GND: C39.2 C41.1 C42.1 C43.2 C44.1 C45.1 R16.2 U4.12(OVLO)
V5V5N: C41.2 C42.2 C43.1 C46.1 C47.2 C48.2 C49.2 C50.1 D9.A Q8.1(S) Q8.2(S) Q8.3(S) R18.2 R19.1 TP7.1 U4.3(SYNC) U4.11(MODE) U4.17(GND) U4.28(BGRTN) U4.38(PGND) U4.39(GND)
V29: C44.2 C45.2 Q7.5(D) Q7.6(D) Q7.7(D) Q7.8(D) Q7.9(D) U4.1(AUXVIN) U4.13(UVLO) U4.14(EN) U4.15(VIN)
5V5N_SENSE_N: R16.4 R17.1 U4.22(SENSE_N)
5V5N_SENSE_P: R16.3 U4.21(SENSE_P)
NetC38_1: C38.1 L5.1 U4.36(AUXSW1)
NetC38_2: C38.2 U4.35(AUXBST)
NetC39_1: C39.1 D8.A U4.30(INTVCC)
NetC40_1: C40.1 D8.K U4.26(BOOST)
NetC40_2: C40.2 D9.K L6.1 Q7.1(S) Q7.2(S) Q7.3(S) Q8.5(D) Q8.6(D) Q8.7(D) Q8.8(D) Q8.9(D) U4.24(SW)
NetC46_2: C46.2 R20.2 U4.8(VC)
NetC47_1: C47.1 U4.19(ICTRL)
NetC48_1: C48.1 R20.1
NetC49_1: C49.1 U4.18(IMON)
NetC50_2: C50.2 R21.2
NetL5_2: L5.2 U4.33(AUXSW2)
NetL6_2: L6.2 R16.1
NetQ7_4: Q7.4(G) U4.25(TG)
NetQ8_4: Q8.4(G) U4.29(BG)
NetR17_2: R17.2 R19.2 U4.7(FB)
NetR18_1: R18.1 U4.4(RT)
NetR21_1: R21.1 U4.20(ICOMP)

Not connected (* = marked no-connect by the designer): U4 2(NC)* 5(NC)* 6(TK/SS)* 9(PG)* 10(NC)* 16(NC)* 23(NC)* 27(NC)* 31(NC)* 32(NC)* 34(NC)* 37(NC)*

### Layout directives
differential pair: 5V5N_SENSE_N, 5V5N_SENSE_P

### Notes on the sheet
- More bulk capacitance
- (near U4) on output of 29V regulator.
- -5.5V @ 0.5A
- (near R18) 629.7 kHz
- 1.25V
- Title
- Engineer
- Revision
- Drawn By
- Checked By
- Date
- Sheet
- of

### Library data of the parts
C38 = CAP: as C10 on sheet power-v3v8; Manufacturer P/N: GRM155R61A105KE15; Package: 0402; Tolerance: ±10%; Voltage: 10V
C39 = TMK212B7475KG: as C11 on sheet power-v3v8; Manufacturer P/N: CL10A475KA8NQNC; Tolerance: ±10%; Package: 0603; Voltage: 25V
C40 = UMK212B7105KG: as C12 on sheet power-v3v8; Manufacturer P/N: GRM155R61A105KE15; Tolerance: ±10%; Tr: *; Package: 0402
C41 C42 = CAP_POL: as C17 on sheet power-v3v8; Manufacturer P/N: TPSE337K010R0050; Tolerance: ±10%
C43 = CAP: as C13 on sheet power-v3v8; Manufacturer P/N: GRM32ER71E226KE15; Tolerance: ±10%
C44 C45 = CAP: as C27 on sheet power-v5v5; Manufacturer P/N: CKG57NX7S1H226M500JJ; Tolerance: ±20%
C46 = CAP: as C19 on sheet power-v3v8; Manufacturer P/N: GRM1555C1H101FA01D; Voltage: 50V; Package: 0402; Tolerance: ±1%
C47 = VJ0402A101KXA: as C20 on sheet power-v3v8; Manufacturer P/N: VJ0402A101KXA; Tolerance: ±10%
C48 = CAP: as C21 on sheet power-v3v8; Manufacturer P/N: GRM1555C1H102JA01; Voltage: 50V; Package: 0402; Tolerance: ±5%
C49 = CAP: as C22 on sheet power-v3v8; Manufacturer P/N: C0402C222J3GACTU; Package: 0402; Tolerance: ±5%; Voltage: 25V
C50 = CAP: as C23 on sheet power-v3v8; Manufacturer P/N: GRM155R71H471JA01; Voltage: 50V; Package: 0402; Tolerance: ±5%
D8 = 1N4448HWS-7-F: as D4 on sheet power-v3v8; Manufacturer P/N: 1N4448HWS-7-F; Package: SOD323
D9 = PDS5100H: as D5 on sheet power-v3v8; Manufacturer P/N: SBR10U200P5-13; Current: 10A; Reverse Voltage (max): 200V; Package: PowerDi-5
L5 = COIL: as L1 on sheet power-v3v8; Manufacturer P/N: ME3220-333KL; I(sat): 500mA; Package: *; Tolerance: ±10%
L6 = COIL: Inductor 33uH,3.7A(sat), SMD; Manufacturer: Coilcraft; Manufacturer P/N: XAL6060-333ME
Q7 Q8 = BSC190N15NS3: as Q5 on sheet power-v5v5; Manufacturer P/N: BSC190N15NS3
R16 = KRL3216T4A-M-R009-F: Current Sense Resistor 100 mOhms +/-1% SMD 4-Terminal; Manufacturer: Susumu; Tolerance: ±1%; Tr: -55:+155; Manufacturer P/N: KRL3216T4A-M-R100-F
R17 = RES: as R11 on sheet power-v5v5; Tcr: *; Manufacturer P/N: RG2012P-682-B-T5; Alternatives: *; Voltage: *; Power: *
R18 = RES: Thin Film Resistor 22k +/-0.5% SMD 0402; Manufacturer: Susumu; Tr: -55:155; Tcr: *; Manufacturer P/N: RR0510P-223-D; Alternatives: *; Voltage: *; Power: *
R19 = RES: as R13 on sheet power-v5v5; Tcr: *; Manufacturer P/N: RR0510P-202-D; Alternatives: *; Voltage: *; Power: *
R20 = RES 0402: as R8 on sheet power-v3v8; Package: 0402; Manufacturer P/N: ERJ-2RKF2212X; Tolerance: ±1%
R21 = RES 0402: as R9 on sheet power-v3v8; Package: 0402; Manufacturer P/N: ERJ-2RKF2672X; Tolerance: ±1%
TP7 = TEST_POINT_SMD_50: Test Point SMD; Manufacturer: Keystone; Manufacturer P/N: 5015
U4 = LT3840EUFE: as U2 on sheet power-v3v8; Manufacturer P/N: LT3840EUFE

## Sheet power-v29.SchDoc: Power 29V
size Letter; CheckedBy: J. Brinton; CompanyName: Signal Laboratories, Inc.; DrawnBy: J. Brinton; Engineer: J. Brinton; Address1: 3479 Edison Way; Address2: Menlo Park CA 94025; Address3: +1 (877) 778-8435; Address4: siglabs.com; Revision: 3; SheetNumber: 1; SheetTotal: 7
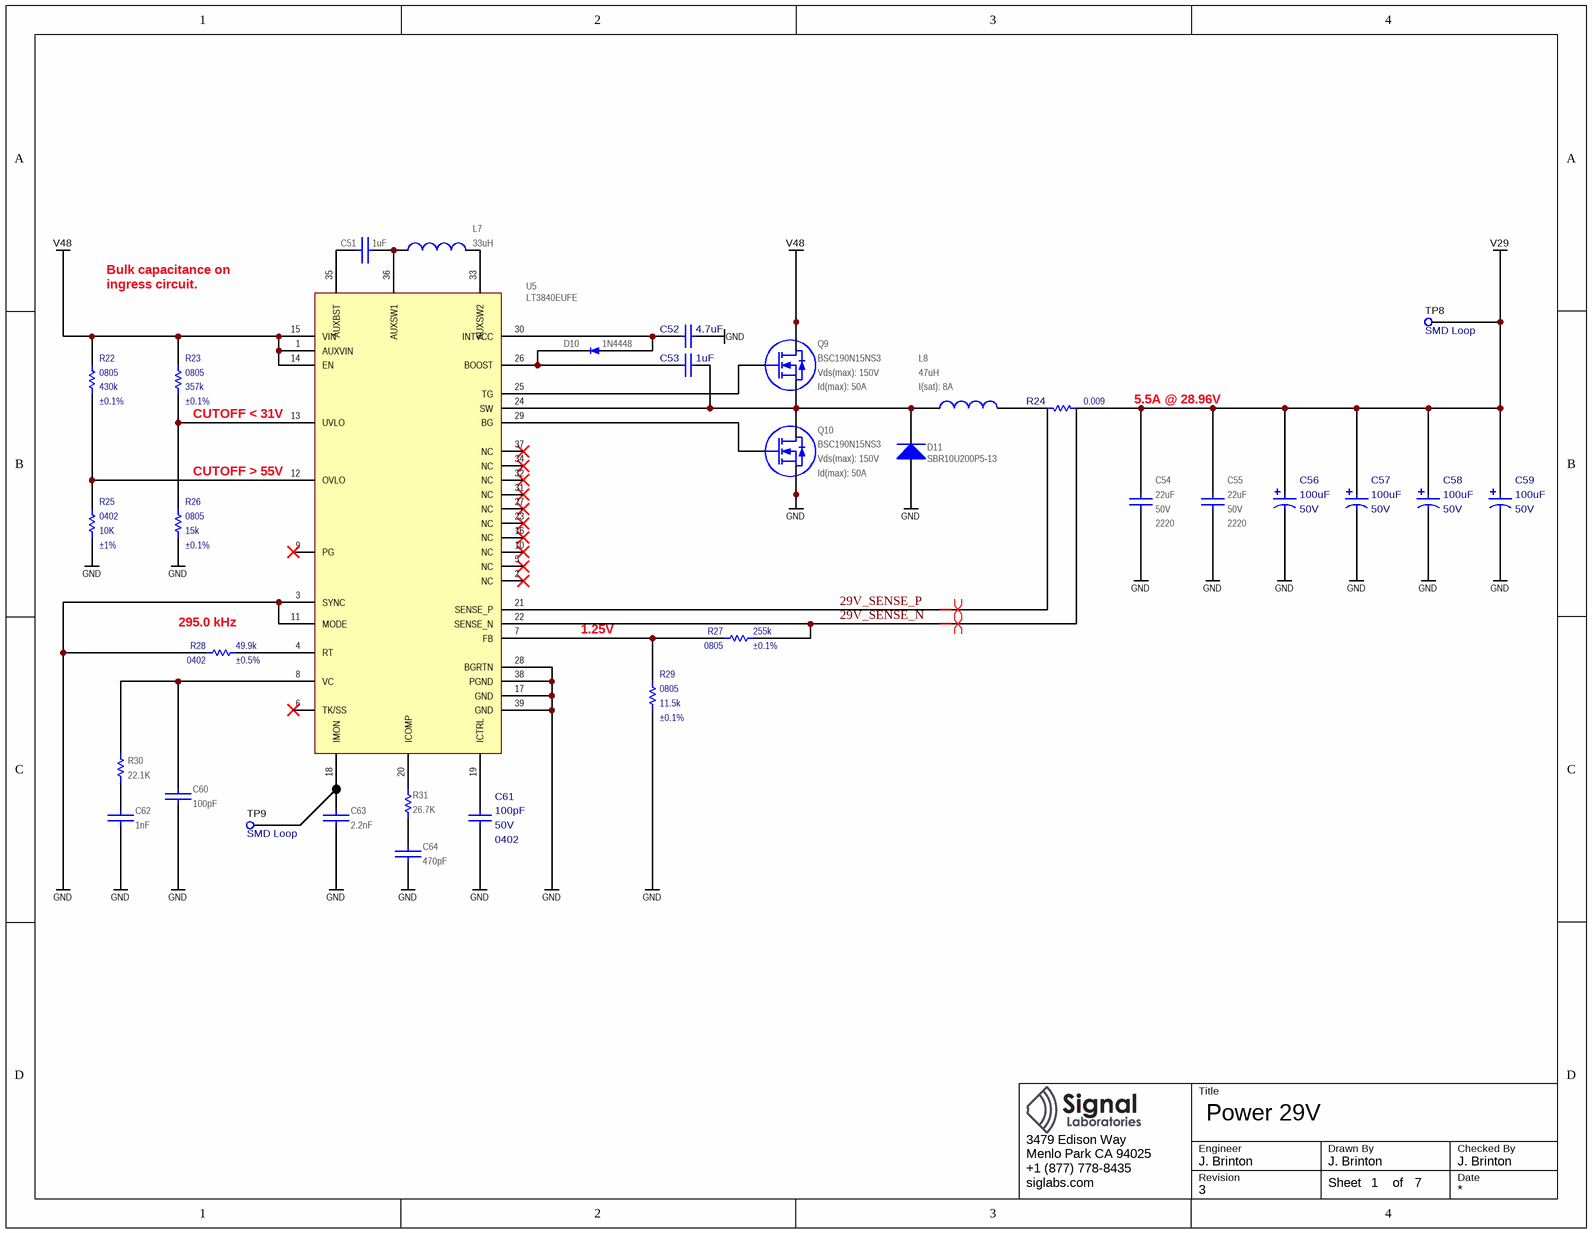
[diagram p4: power-v29.SchDoc]

### Parts
C51  value 1uF  [CAPC100X50X55L25N]  (hidden comment: GRM155R61A105KE15)
C52  value 4.7uF  [CAPC160X80X90L20NA]  (hidden comment: CL10A475KA8NQNC)
C53  value 1uF  [CAPC100X50X55L25N]  (hidden comment: GRM155R61A105KE15)
C54  value 22uF  Voltage: 50V  Package: 2220  [CAPC600X500X500L160N]  (hidden comment: CKG57NX7S1H226M500JJ)
C55  value 22uF  Voltage: 50V  Package: 2220  [CAPC600X500X500L160N]  (hidden comment: CKG57NX7S1H226M500JJ)
C56  value 100uF  Voltage: 50V  [CAPAE660X800D700L260X65N]  (hidden comment: EEE-FTH101XAP)
C57  value 100uF  Voltage: 50V  [CAPAE660X800D700L260X65N]  (hidden comment: EEE-FTH101XAP)
C58  value 100uF  Voltage: 50V  [CAPAE660X800D700L260X65N]  (hidden comment: EEE-FTH101XAP)
C59  value 100uF  Voltage: 50V  [CAPAE660X800D700L260X65N]  (hidden comment: EEE-FTH101XAP)
C60  value 100pF  [CAPC100X50X55L25N]  (hidden comment: GRM1555C1H101FA01D)
C61  value 100pF  Package: 0402  Voltage: 50V  [CAPC100X50X55L25N]  (hidden comment: VJ0402A101KXA)
C62  value 1nF  [CAPC100X50X55L25N]  (hidden comment: GRM1555C1H102JA01)
C63  value 2.2nF  [CAPC100X50X55L25N]  (hidden comment: C0402C222J3GACTU)
C64  value 470pF  [CAPC100X50X55L25N]  (hidden comment: GRM155R71H471JA01)
D10  Alternative P/N: 1N4448  [SOD323]  (hidden comment: 1N4448HWS-7-F)
D11  SBR10U200P5-13  [DIODES_POWERDI5]
L7  value 33uH  [ME3220]  (hidden comment: ME3220-333KL)
L8  value 47uH  I(sat): 8A  [HCM1A1707]  (hidden comment: HCM1A1707-470-R)
Q9  BSC190N15NS3  Vds(max): 150V  Id(max): 50A  [TDSON-8]
Q10  BSC190N15NS3  Vds(max): 150V  Id(max): 50A  [TDSON-8]
R22  value 430k  Tolerance: ±0.1%  Package: 0805  [RESC2012X70N]  (hidden comment: RT0805BRD07430KL)
R23  value 357k  Tolerance: ±0.1%  Package: 0805  [RESC2012X70N]  (hidden comment: RT0805BRD07357KL)
R24  value 0.009  [KRL3216T4]  (hidden comment: KRL3216T4A-M-R009-F)
R25  value 10K  Tolerance: ±1%  Package: 0402  [RESC2012X70N]  (hidden comment: ERJ-2RKF1002X)
R26  value 15k  Tolerance: ±0.1%  Package: 0805  [RESC2012X70N]  (hidden comment: RG2012P-153-B-T5)
R27  value 255k  Tolerance: ±0.1%  Package: 0805  [RESC2012X70N]  (hidden comment: PTN0805E2553BST1)
R28  value 49.9k  Tolerance: ±0.5%  Package: 0402  [RESC1005X40N]  (hidden comment: RR0510P-4992-D)
R29  value 11.5k  Tolerance: ±0.1%  Package: 0805  [RESC2012X70N]  (hidden comment: RT0805BRD0711K5L)
R30  value 22.1K  [RESC1005X40N]  (hidden comment: ERJ-2RKF2212X)
R31  value 26.7K  [RESC1005X40N]  (hidden comment: ERJ-2RKF2672X)
TP8  Notes: SMD Loop  [5015]  (hidden comment: 5015)
TP9  Notes: SMD Loop  [5015]  (hidden comment: 5015)
U5  LT3840EUFE  [QFN39P40_600X400X80L40X20T465X265N]

### Nets
GND: C52.2 C54.1 C55.1 C56.2 C57.2 C58.2 C59.2 C60.1 C61.2 C62.2 C63.2 C64.1 D11.A Q10.1(S) Q10.2(S) Q10.3(S) R25.1 R26.1 R28.2 R29.1 U5.3(SYNC) U5.11(MODE) U5.17(GND) U5.28(BGRTN) U5.38(PGND) U5.39(GND)
V29: C54.2 C55.2 C56.1 C57.1 C58.1 C59.1 R24.2 TP8.1
V48: Q9.5(D) Q9.6(D) Q9.7(D) Q9.8(D) Q9.9(D) R22.2 R23.2 U5.1(AUXVIN) U5.14(EN) U5.15(VIN)
29V_SENSE_N: R24.4 R27.1 U5.22(SENSE_N)
29V_SENSE_P: R24.3 U5.21(SENSE_P)
NetC51_1: C51.1 L7.1 U5.36(AUXSW1)
NetC51_2: C51.2 U5.35(AUXBST)
NetC52_1: C52.1 D10.A U5.30(INTVCC)
NetC53_1: C53.1 D10.K U5.26(BOOST)
NetC53_2: C53.2 D11.K L8.1 Q9.1(S) Q9.2(S) Q9.3(S) Q10.5(D) Q10.6(D) Q10.7(D) Q10.8(D) Q10.9(D) U5.24(SW)
NetC60_2: C60.2 R30.2 U5.8(VC)
NetC61_1: C61.1 U5.19(ICTRL)
NetC62_1: C62.1 R30.1
NetC63_1: C63.1 TP9.1 U5.18(IMON)
NetC64_2: C64.2 R31.2
NetL7_2: L7.2 U5.33(AUXSW2)
NetL8_2: L8.2 R24.1
NetQ9_4: Q9.4(G) U5.25(TG)
NetQ10_4: Q10.4(G) U5.29(BG)
NetR22_1: R22.1 R25.2 U5.12(OVLO)
NetR23_1: R23.1 R26.2 U5.13(UVLO)
NetR27_2: R27.2 R29.2 U5.7(FB)
NetR28_1: R28.1 U5.4(RT)
NetR31_1: R31.1 U5.20(ICOMP)

Not connected (* = marked no-connect by the designer): U5 2(NC)* 5(NC)* 6(TK/SS)* 9(PG)* 10(NC)* 16(NC)* 23(NC)* 27(NC)* 31(NC)* 32(NC)* 34(NC)* 37(NC)*

### Layout directives
differential pair: 29V_SENSE_N, 29V_SENSE_P

### Notes on the sheet
- Bulk capacitance on
- ingress circuit.
- (near R23) CUTOFF < 31V
- 5.5A @ 28.96V
- CUTOFF > 55V
- (near R28) 295.0 kHz
- 1.25V
- Title
- Engineer
- Revision
- Drawn By
- Checked By
- Date
- Sheet
- of

### Library data of the parts
C51 = CAP: as C10 on sheet power-v3v8; Manufacturer P/N: GRM155R61A105KE15; Package: 0402; Tolerance: ±10%; Voltage: 10V
C52 = TMK212B7475KG: as C11 on sheet power-v3v8; Manufacturer P/N: CL10A475KA8NQNC; Tolerance: ±10%; Package: 0603; Voltage: 25V
C53 = UMK212B7105KG: Ceramic Capacitor 1uF ±10% 10V X5R 0402; Manufacturer: Murata; Manufacturer P/N: GRM155R61A105KE15; Tolerance: ±10%; Tr: *; Package: 0402; Voltage: 10V
C54 C55 = CAP: as C27 on sheet power-v5v5; Manufacturer P/N: CKG57NX7S1H226M500JJ; Tolerance: ±20%
C56-C59 = CAP_POL: Aluminum Electrolytic Capacitor 100uF ±20% 50V; Manufacturer: Panasonic; Tr: -55:105; Manufacturer P/N: EEE-FTH101XAP; Tolerance: ±20%; Package: 6.3mm Radial
C60 = CAP: as C19 on sheet power-v3v8; Manufacturer P/N: GRM1555C1H101FA01D; Voltage: 50V; Package: 0402; Tolerance: ±1%
C61 = VJ0402A101KXA: as C20 on sheet power-v3v8; Manufacturer P/N: VJ0402A101KXA; Tolerance: ±10%
C62 = CAP: as C21 on sheet power-v3v8; Manufacturer P/N: GRM1555C1H102JA01; Voltage: 50V; Package: 0402; Tolerance: ±5%
C63 = CAP: as C22 on sheet power-v3v8; Manufacturer P/N: C0402C222J3GACTU; Package: 0402; Tolerance: ±5%; Voltage: 25V
C64 = CAP: as C23 on sheet power-v3v8; Manufacturer P/N: GRM155R71H471JA01; Voltage: 50V; Package: 0402; Tolerance: ±5%
D10 = 1N4448HWS-7-F: as D4 on sheet power-v3v8; Manufacturer P/N: 1N4448HWS-7-F; Package: SOD323
D11 = PDS5100H: as D5 on sheet power-v3v8; Manufacturer P/N: SBR10U200P5-13; Current: 10A; Reverse Voltage (max): 200V; Package: PowerDi-5
L7 = COIL: as L1 on sheet power-v3v8; Manufacturer P/N: ME3220-333KL; I(sat): 500mA; Package: *; Tolerance: ±10%
L8 = COIL: Inductor 47uH, 8A(sat), SMD; Manufacturer: Eaton; Manufacturer P/N: HCM1A1707-470-R
Q9 Q10 = BSC190N15NS3: as Q5 on sheet power-v5v5; Manufacturer P/N: BSC190N15NS3
R22 = RES: Thin Film Resistor 430k +/-0.1% SMD 0805; Manufacturer: Yageo; Tr: -55:155; Tcr: *; Manufacturer P/N: RT0805BRD07430KL; Alternatives: *; Voltage: *; Power: *
R23 = RES: Thin Film Resistor 357k +/-0.1% SMD 0805; Manufacturer: Yageo; Tr: -55:155; Tcr: *; Manufacturer P/N: RT0805BRD07357KL; Alternatives: *; Voltage: *; Power: *
R24 = KRL3216T4A-M-R009-F: Current Sense Resistor 9 mOhms +/-1% SMD 4-Terminal; Manufacturer: Susumu; Tolerance: ±1%; Tr: -55:+155; Manufacturer P/N: KRL3216T4A-M-R009-F
R25 = RES: Thick Film Resistor 10k ±1% 0.1W 50V 0402; Manufacturer: Panasonic; Tr: -55:155; Tcr: *; Manufacturer P/N: ERJ-2RKF1002X; Alternatives: *; Voltage: *; Power: *
R26 = RES: Thin Film Resistor 15k +/-0.1% SMD 0805; Manufacturer: Susumu; Tr: -55:155; Tcr: *; Manufacturer P/N: RG2012P-153-B-T5; Alternatives: *; Voltage: *; Power: *
R27 = RES: Thin Film Resistor 255k +/-0.1% SMD 0805; Manufacturer: Vishay; Tr: -55:155; Tcr: *; Manufacturer P/N: PTN0805E2553BST1; Alternatives: *; Voltage: *; Power: *
R28 = RES: Thin Film Resistor 49.9k +/-0.5% SMD 0402; Manufacturer: Susumu; Tr: -55:155; Tcr: *; Manufacturer P/N: RR0510P-4992-D; Alternatives: *; Voltage: *; Power: *
R29 = RES: Thin Film Resistor 11.5k +/-0.1% SMD 0805; Manufacturer: Yageo; Tr: -55:155; Tcr: *; Manufacturer P/N: RT0805BRD0711K5L; Alternatives: *; Voltage: *; Power: *
R30 = RES 0402: as R8 on sheet power-v3v8; Package: 0402; Manufacturer P/N: ERJ-2RKF2212X; Tolerance: ±1%
R31 = RES 0402: as R9 on sheet power-v3v8; Package: 0402; Manufacturer P/N: ERJ-2RKF2672X; Tolerance: ±1%
TP8 TP9 = TEST_POINT_SMD_50: Test Point SMD; Manufacturer: Keystone; Manufacturer P/N: 5015
U5 = LT3840EUFE: as U2 on sheet power-v3v8; Manufacturer P/N: LT3840EUFE

## Sheet egress.SchDoc: Power Egress
size Letter; CompanyName: Signal Laboratories, Inc.; DrawnBy: J. Brinton; Engineer: J. Brinton; Address1: 3479 Edison Way; Address2: Menlo Park CA 94025; Address3: +1 (877) 778-8435; Address4: siglabs.com; Revision: 1; SheetNumber: 6; SheetTotal: 7
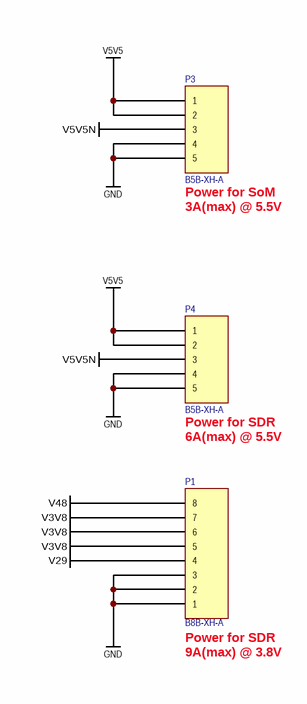
[diagram p5: egress.SchDoc]

### Parts
P1  B8B-XH-A  [B8B-XH-A]
P3  B5B-XH-A  [B5B-XH-A]
P4  B5B-XH-A  [B5B-XH-A]

### Nets
GND: P1.1 P1.2 P1.3 P3.4 P3.5 P4.4 P4.5
V3V8: P1.5 P1.6 P1.7
V5V5: P3.1 P3.2 P4.1 P4.2
V5V5N: P3.3 P4.3
V29: P1.4
V48: P1.8

### Notes on the sheet
- (near P3) Power for SoM
- (near P3) 3A(max) @ 5.5V
- (near P4) Power for SDR
- 6A(max) @ 5.5V
- (near P1) Power for SDR
- (near P1) 9A(max) @ 3.8V
- Title
- Engineer
- Revision
- Drawn By
- Checked By
- Date
- Sheet
- of

### Library data of the parts
P1 = S8B-XH-A: 2.5mm pitch 8-position connector; Manufacturer: JST; Manufacturer P/N: B8B-XH-A
P3 P4 = S5B-XH-A: 2.5mm pitch 5-position connector; Manufacturer: JST; Manufacturer P/N: B5B-XH-A

## Sheet mechanical.SchDoc: Mechanical
size Letter; CompanyName: Signal Laboratories, Inc.; DrawnBy: J. Brinton; Engineer: J. Brinton; Address1: 3479 Edison Way; Address2: Menlo Park CA 94025; Address3: +1 (877) 778-8435; Address4: siglabs.com; Revision: 1; SheetNumber: 7; SheetTotal: 7
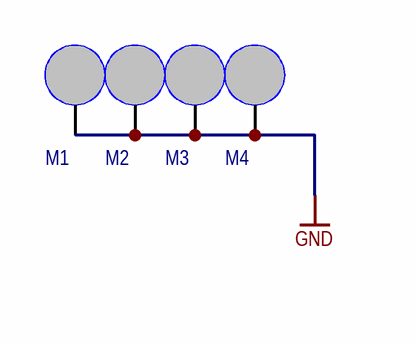
[diagram p6: mechanical.SchDoc]

### Parts
M1  MOUNTM3_CORNERS  [MOUNTM3_CORNERS]  (value not drawn)  (no BOM)
M2  MOUNTM3_CORNERS  [MOUNTM3_CORNERS]  (value not drawn)  (no BOM)
M3  MOUNTM3_CORNERS  [MOUNTM3_CORNERS]  (value not drawn)  (no BOM)
M4  MOUNTM3_CORNERS  [MOUNTM3_CORNERS]  (value not drawn)  (no BOM)

### Nets
GND: M1.1(MNT) M2.1(MNT) M3.1(MNT) M4.1(MNT)

### Notes on the sheet
- Title
- Engineer
- Revision
- Drawn By
- Checked By
- Date
- Sheet
- of

### Library data of the parts
M1-M4 = MOUNT: Manufacturer: *; Manufacturer P/N: *

## Nets that join several sheets
GND: ingress (11 pins), power-v3v8 (25 pins), power-v5v5 (25 pins), power-v5v5n (8 pins), power-v29 (26 pins), egress (7 pins), mechanical (M1.1 M2.1 M3.1 M4.1)
V3V8: power-v3v8 (6 pins), egress (P1.5 P1.6 P1.7)
V5V5: power-v3v8 (11 pins), power-v5v5 (6 pins), egress (P3.1 P3.2 P4.1 P4.2)
V5V5N: power-v5v5n (21 pins), egress (P3.3 P4.3)
V29: power-v5v5 (11 pins), power-v5v5n (11 pins), power-v29 (8 pins), egress (P1.4)
V48: ingress (15 pins), power-v29 (10 pins), egress (P1.8)